# Altium schematic sheet [2] Power.SchDoc
size A4
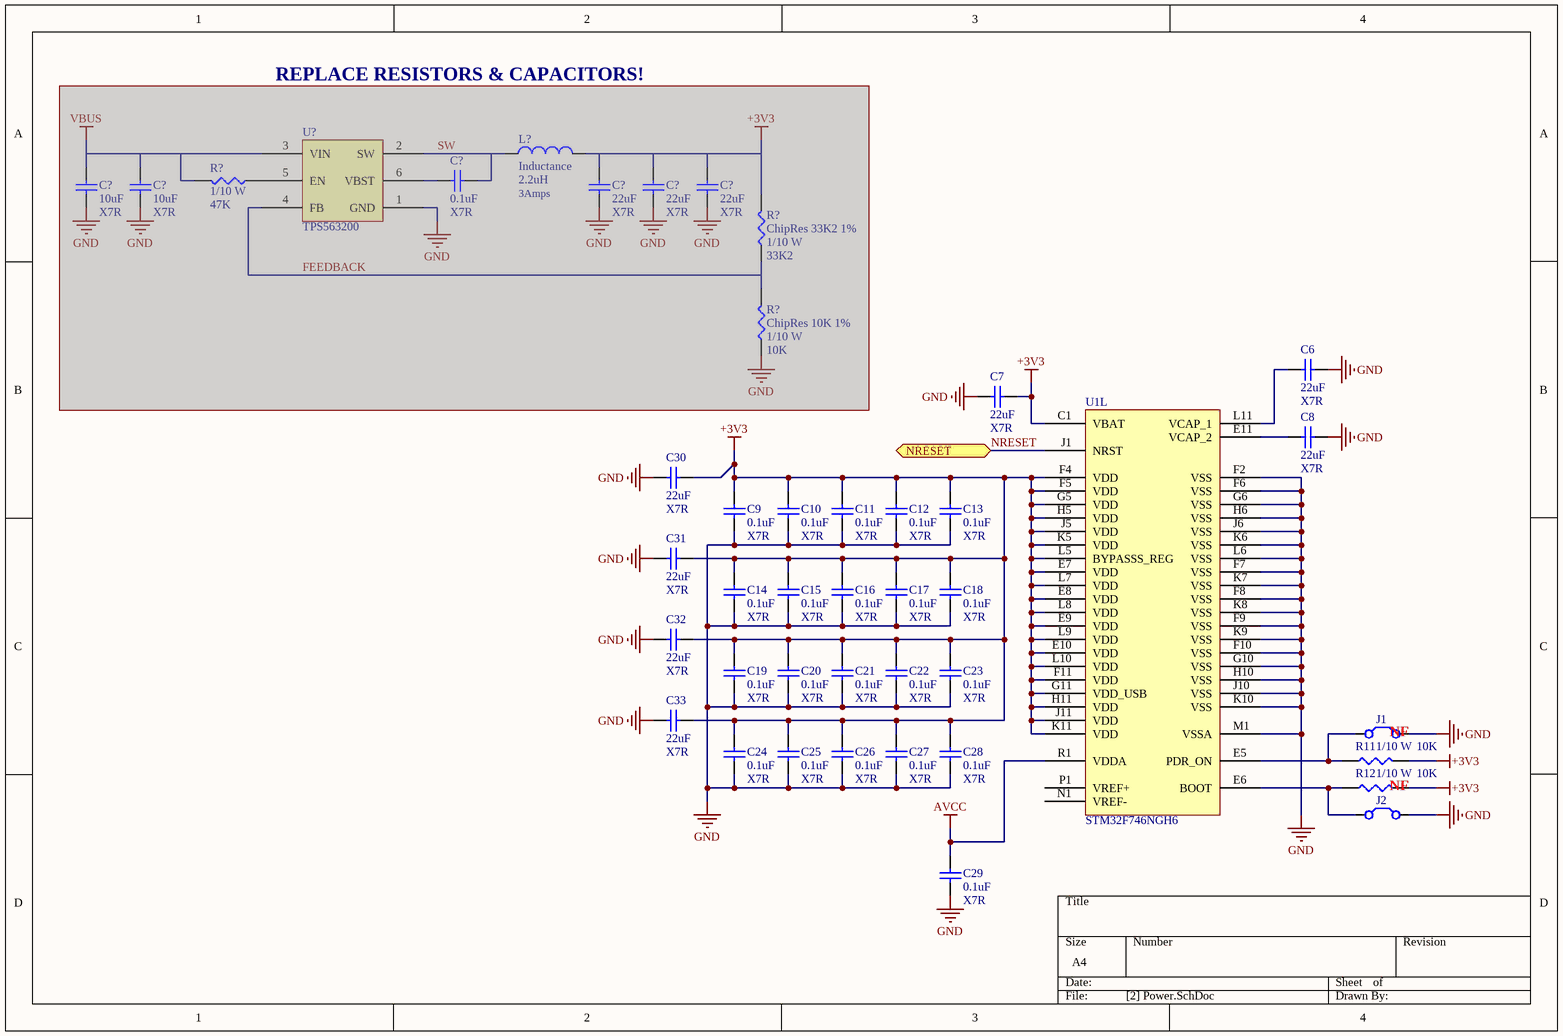
[diagram p0: [2] Power.SchDoc]

## Parts
(Parts that share a designator on the sheet are numbered #1, #2 ... from top to bottom, then left to right.)
C6  value 22uF  Type: X7R  [CAP0603]  (hidden comment: ChipCap 22u X7R)
C7  value 22uF  Type: X7R  [CAP0805]  (hidden comment: ChipCap 22u X7R)
C8  value 22uF  Type: X7R  [CAP0603]  (hidden comment: ChipCap 22u X7R)
C9  value 0.1uF  Type: X7R  [CAP0201]  (hidden comment: ChipCap 0.1u X7R)
C10  value 0.1uF  Type: X7R  [CAP0201]  (hidden comment: ChipCap 0.1u X7R)
C11  value 0.1uF  Type: X7R  [CAP0201]  (hidden comment: ChipCap 0.1u X7R)
C12  value 0.1uF  Type: X7R  [CAP0201]  (hidden comment: ChipCap 0.1u X7R)
C13  value 0.1uF  Type: X7R  [CAP0201]  (hidden comment: ChipCap 0.1u X7R)
C14  value 0.1uF  Type: X7R  [CAP0201]  (hidden comment: ChipCap 0.1u X7R)
C15  value 0.1uF  Type: X7R  [CAP0201]  (hidden comment: ChipCap 0.1u X7R)
C16  value 0.1uF  Type: X7R  [CAP0201]  (hidden comment: ChipCap 0.1u X7R)
C17  value 0.1uF  Type: X7R  [CAP0201]  (hidden comment: ChipCap 0.1u X7R)
C18  value 0.1uF  Type: X7R  [CAP0201]  (hidden comment: ChipCap 0.1u X7R)
C19  value 0.1uF  Type: X7R  [CAP0201]  (hidden comment: ChipCap 0.1u X7R)
C20  value 0.1uF  Type: X7R  [CAP0201]  (hidden comment: ChipCap 0.1u X7R)
C21  value 0.1uF  Type: X7R  [CAP0201]  (hidden comment: ChipCap 0.1u X7R)
C22  value 0.1uF  Type: X7R  [CAP0201]  (hidden comment: ChipCap 0.1u X7R)
C23  value 0.1uF  Type: X7R  [CAP0201]  (hidden comment: ChipCap 0.1u X7R)
C24  value 0.1uF  Type: X7R  [CAP0201]  (hidden comment: ChipCap 0.1u X7R)
C25  value 0.1uF  Type: X7R  [CAP0201]  (hidden comment: ChipCap 0.1u X7R)
C26  value 0.1uF  Type: X7R  [CAP0201]  (hidden comment: ChipCap 0.1u X7R)
C27  value 0.1uF  Type: X7R  [CAP0201]  (hidden comment: ChipCap 0.1u X7R)
C28  value 0.1uF  Type: X7R  [CAP0201]  (hidden comment: ChipCap 0.1u X7R)
C29  value 0.1uF  Type: X7R  [CAP0603]  (hidden comment: ChipCap 0.1u X7R)
C30  value 22uF  Type: X7R  [CAP0603]  (hidden comment: ChipCap 22u X7R)
C31  value 22uF  Type: X7R  [CAP0603]  (hidden comment: ChipCap 22u X7R)
C32  value 22uF  Type: X7R  [CAP0805]  (hidden comment: ChipCap 22u X7R)
C33  value 22uF  Type: X7R  [CAP0805]  (hidden comment: ChipCap 22u X7R)
C?#1  value 10uF  Type: X7R  [CAP1210]  (hidden comment: ChipCap 10u X7R)  (masked out: inside a compile mask, not in the netlist)
C?#2  value 10uF  Type: X7R  [CAP1210]  (hidden comment: ChipCap 10u X7R)  (masked out: inside a compile mask, not in the netlist)
C?#3  value 0.1uF  Type: X7R  [CAP0603]  (hidden comment: ChipCap 0.1u X7R)  (masked out: inside a compile mask, not in the netlist)
C?#4  value 22uF  Type: X7R  [CAP1210]  (hidden comment: ChipCap 22u X7R)  (masked out: inside a compile mask, not in the netlist)
C?#5  value 22uF  Type: X7R  [CAP1210]  (hidden comment: ChipCap 22u X7R)  (masked out: inside a compile mask, not in the netlist)
C?#6  value 22uF  Type: X7R  [CAP1210]  (hidden comment: ChipCap 22u X7R)  (masked out: inside a compile mask, not in the netlist)
J1  Jumper  [J0603]  (value not drawn)
J2  Jumper  [J0603]  (value not drawn)
L?  Inductance  value 2.2uH  [CDRH5D28RHP]  (masked out: inside a compile mask, not in the netlist)
R11  value 10K  Rating: 1/10 W  [RES0805]  (hidden comment: ChipRes 10K 1%)
R12  value 10K  Rating: 1/10 W  [RES0805]  (hidden comment: ChipRes 10K 1%)
R?#1  value 47K  Rating: 1/10 W  [RES0603]  (hidden comment: ChipRes 47K 1%)  (masked out: inside a compile mask, not in the netlist)
R?#2  ChipRes 33K2 1%  value 33K2  Rating: 1/10 W  [RES0603]  (masked out: inside a compile mask, not in the netlist)
R?#3  ChipRes 10K 1%  value 10K  Rating: 1/10 W  [RES0603]  (masked out: inside a compile mask, not in the netlist)
U1  STM32F746NGH6  [TFBGA216]  (part L of 12)
U?  TPS563200  [SOT23-6]  (masked out: inside a compile mask, not in the netlist)

## Ports
NRESET

## Nets
+3V3: C7.1 C9.2 C10.2 C11.2 C12.2 C13.2 C14.2 C15.2 C16.2 C17.2 C18.2 C19.2 C20.2 C21.2 C22.2 C23.2 C24.2 C25.2 C26.2 C27.2 C28.2 C30.1 C31.1 C32.1 C33.1 R11.1 R12.1 U1.C1(VBAT) U1.E7(VDD) U1.E8(VDD) U1.E9(VDD) U1.E10(VDD) U1.F4(VDD) U1.F5(VDD) U1.F11(VDD) U1.G5(VDD) U1.G11(VDD_USB) U1.H5(VDD) U1.H11(VDD) U1.J5(VDD) U1.J11(VDD) U1.K5(VDD) U1.K11(VDD) U1.L5(BYPASSS_REG) U1.L7(VDD) U1.L8(VDD) U1.L9(VDD) U1.L10(VDD)
AVCC: C29.2 U1.R1(VDDA)
GND: C6.1 C7.2 C8.1 C9.1 C10.1 C11.1 C12.1 C13.1 C14.1 C15.1 C16.1 C17.1 C18.1 C19.1 C20.1 C21.1 C22.1 C23.1 C24.1 C25.1 C26.1 C27.1 C28.1 C29.1 C30.2 C31.2 C32.2 C33.2 J1.1 J2.1 U1.F2(VSS) U1.F6(VSS) U1.F7(VSS) U1.F8(VSS) U1.F9(VSS) U1.F10(VSS) U1.G6(VSS) U1.G10(VSS) U1.H6(VSS) U1.H10(VSS) U1.J6(VSS) U1.J10(VSS) U1.K6(VSS) U1.K7(VSS) U1.K8(VSS) U1.K9(VSS) U1.K10(VSS) U1.L6(VSS) U1.M1(VSSA)
NRESET: U1.J1(NRST) ; port NRESET
NetC6_2: C6.2 U1.L11(VCAP_1)
NetC8_2: C8.2 U1.E11(VCAP_2)
NetJ1_2: J1.2 R11.2 U1.E5(PDR_ON)
NetJ2_2: J2.2 R12.2 U1.E6(BOOT)

Not connected (* = marked no-connect by the designer): U1 N1(VREF-) P1(VREF+)

## Notes on the sheet
- REPLACE RESISTORS & CAPACITORS!
- 3Amps
- (near J1) NF
- (near R12) NF

## Library data of the parts
C6-C8 C30-C33 C?#4-C?#6 = ChipCap 22uF X7R: Surface-mount ceramic multilayer capacitor; Manufacturer: YAGEO; Voltage: 25V; Tolerance: 10%; ComponentLink1Description: Datasheet; ComponentLink1URL: http://www.deaha.com/pdf/YAGEO-CC_series.pdf
C9-C29 C?#3 = ChipCap 0.1uF X7R: Surface-mount ceramic multilayer capacitor; Manufacturer: YAGEO; Voltage: 100V; Tolerance: 10%; ComponentLink1Description: Datasheet; ComponentLink1URL: http://www.deaha.com/pdf/YAGEO-CC_series.pdf
C?#1 C?#2 = ChipCap 10uF X7R: Surface-mount ceramic multilayer capacitor; Manufacturer: YAGEO; Voltage: 25V; Tolerance: 10%; ComponentLink1Description: Datasheet; ComponentLink1URL: http://www.deaha.com/pdf/YAGEO-CC_series.pdf
L? = ChipInductance
R11 R12 R?#3 = ChipRes 10K 1%: Think Film Chip resistor; Temperature Coefficient: 200ppm/K; Tolerance: 1%; Type: ThickFilm
R?#1 = ChipRes 47K 1%: Think Film Chip resistor; Temperature Coefficient: 200ppm/K; Tolerance: 1%; Type: ThickFilm
R?#2 = ChipRes 33K2 1%: Think Film Chip resistor; Temperature Coefficient: 200ppm/K; Tolerance: 1%; Type: ThickFilm
U1 = STM32F746NGH6: ARM Cortex M7, 462DMIPS, 1MB Flash
U? = TPS563200: 3A Synchronous Step-Down Voltage Regulator; Voltage: 4.5-17V; Current: 3Amps; ComponentLink1Description: Datasheet; ComponentLink1URL: www.ti.com/lit/ds/symlink/tps563200.pdf; Supplier 1: Compel; Supplier URL 1: www.compel.ru; Supplier Part Number 1: TPS563200DDCT